# Altium schematic sheet Mux side B (5-8).SchDoc
size A0; SheetNumber: 3; SheetTotal: 5
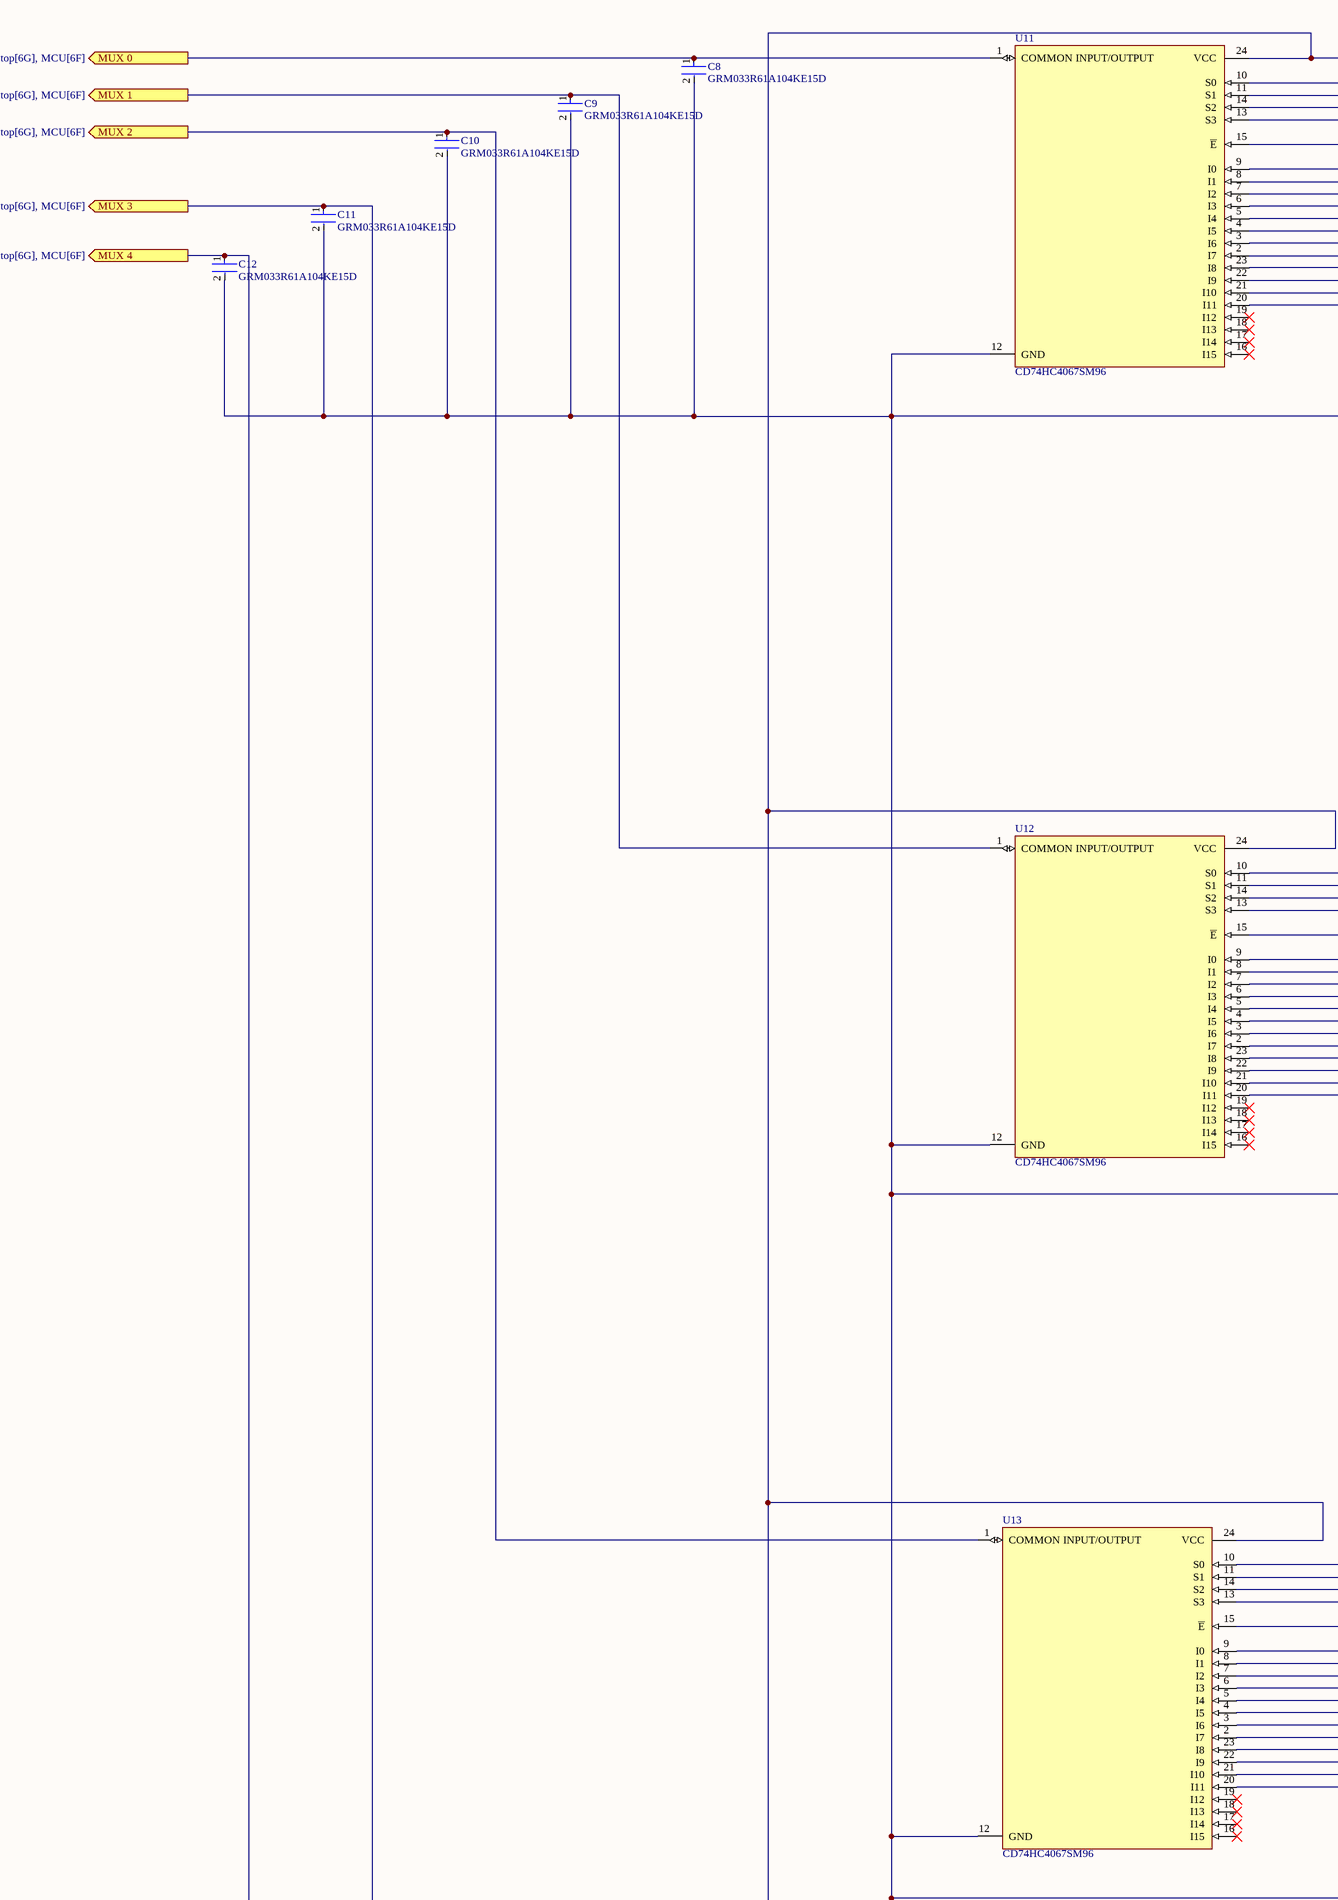
[diagram p0: Mux side B (5-8).SchDoc, top left]
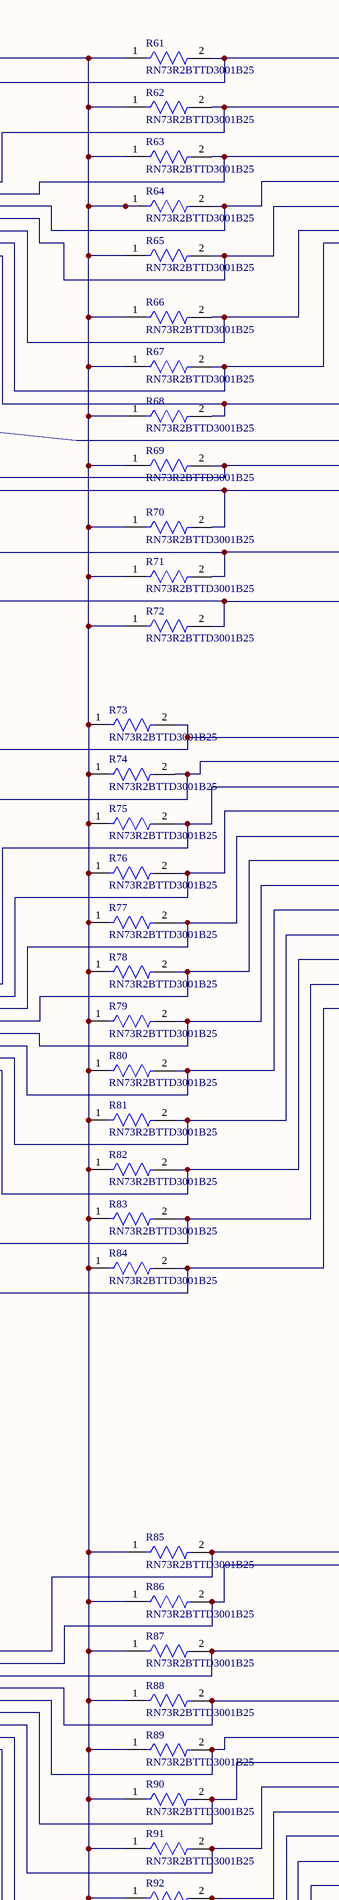
[diagram p1: Mux side B (5-8).SchDoc, top middle]
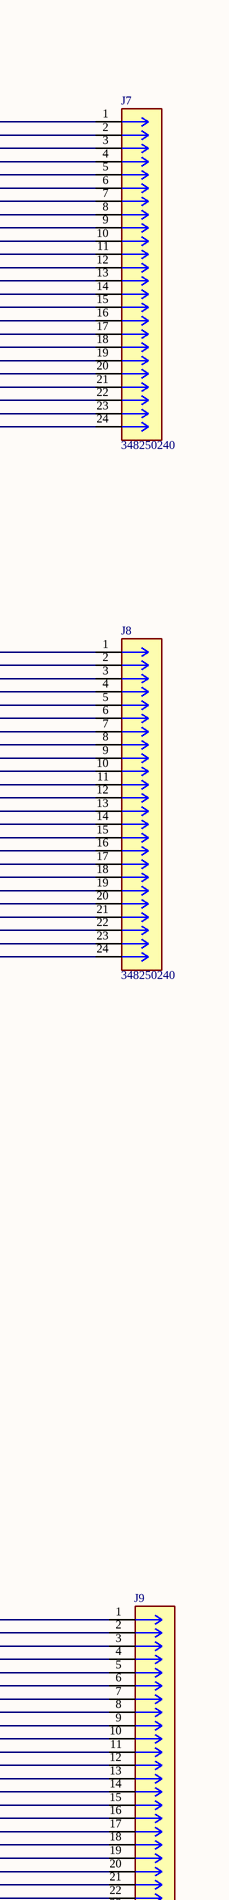
[diagram p2: Mux side B (5-8).SchDoc, top right]
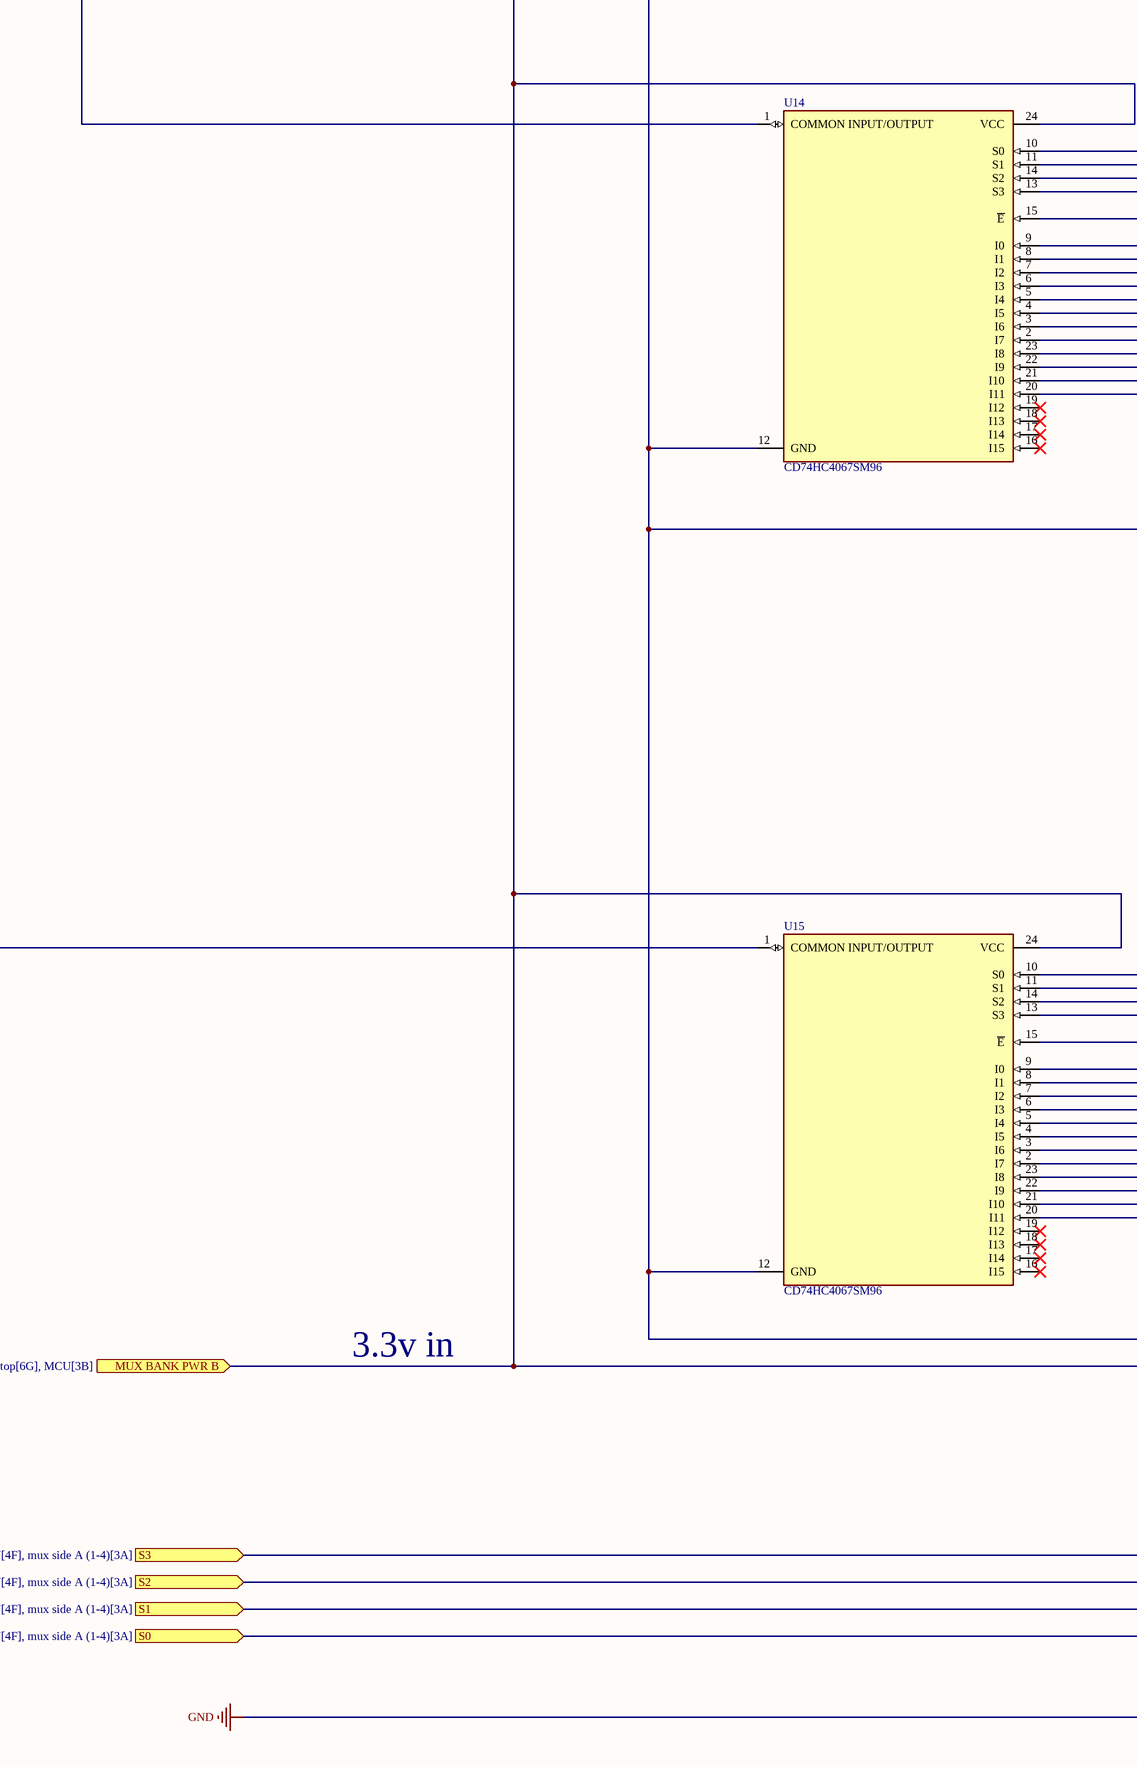
[diagram p3: Mux side B (5-8).SchDoc, bottom left]
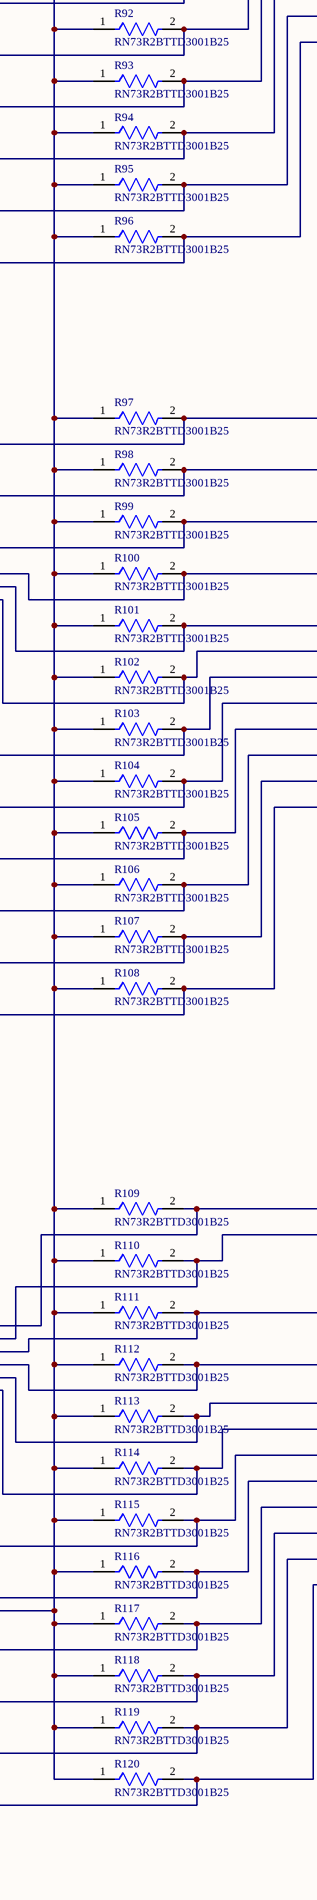
[diagram p4: Mux side B (5-8).SchDoc, bottom middle]
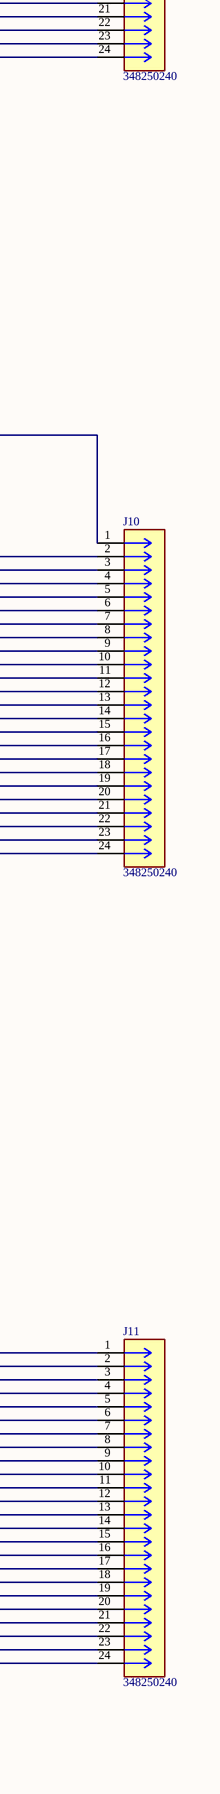
[diagram p5: Mux side B (5-8).SchDoc, bottom right]

## Parts
C8  GRM033R61A104KE15D  [FP-GRM033-0_03-IPC_C]
C9  GRM033R61A104KE15D  [FP-GRM033-0_03-IPC_C]
C10  GRM033R61A104KE15D  [FP-GRM033-0_03-IPC_C]
C11  GRM033R61A104KE15D  [FP-GRM033-0_03-IPC_C]
C12  GRM033R61A104KE15D  [FP-GRM033-0_03-IPC_C]
J7  348250240  [CONN_SD-34825-001_24_MOL]
J8  348250240  [CONN_SD-34825-001_24_MOL]
J9  348250240  [CONN_SD-34825-001_24_MOL]
J10  348250240  [CONN_SD-34825-001_24_MOL]
J11  348250240  [CONN_SD-34825-001_24_MOL]
R61  RN73R2BTTD3001B25  [FP-RN73R2B-IPC_A]
R62  RN73R2BTTD3001B25  [FP-RN73R2B-IPC_A]
R63  RN73R2BTTD3001B25  [FP-RN73R2B-IPC_A]
R64  RN73R2BTTD3001B25  [FP-RN73R2B-IPC_A]
R65  RN73R2BTTD3001B25  [FP-RN73R2B-IPC_A]
R66  RN73R2BTTD3001B25  [FP-RN73R2B-IPC_A]
R67  RN73R2BTTD3001B25  [FP-RN73R2B-IPC_A]
R68  RN73R2BTTD3001B25  [FP-RN73R2B-IPC_A]
R69  RN73R2BTTD3001B25  [FP-RN73R2B-IPC_A]
R70  RN73R2BTTD3001B25  [FP-RN73R2B-IPC_A]
R71  RN73R2BTTD3001B25  [FP-RN73R2B-IPC_A]
R72  RN73R2BTTD3001B25  [FP-RN73R2B-IPC_A]
R73  RN73R2BTTD3001B25  [FP-RN73R2B-IPC_A]
R74  RN73R2BTTD3001B25  [FP-RN73R2B-IPC_A]
R75  RN73R2BTTD3001B25  [FP-RN73R2B-IPC_A]
R76  RN73R2BTTD3001B25  [FP-RN73R2B-IPC_A]
R77  RN73R2BTTD3001B25  [FP-RN73R2B-IPC_A]
R78  RN73R2BTTD3001B25  [FP-RN73R2B-IPC_A]
R79  RN73R2BTTD3001B25  [FP-RN73R2B-IPC_A]
R80  RN73R2BTTD3001B25  [FP-RN73R2B-IPC_A]
R81  RN73R2BTTD3001B25  [FP-RN73R2B-IPC_A]
R82  RN73R2BTTD3001B25  [FP-RN73R2B-IPC_A]
R83  RN73R2BTTD3001B25  [FP-RN73R2B-IPC_A]
R84  RN73R2BTTD3001B25  [FP-RN73R2B-IPC_A]
R85  RN73R2BTTD3001B25  [FP-RN73R2B-IPC_A]
R86  RN73R2BTTD3001B25  [FP-RN73R2B-IPC_A]
R87  RN73R2BTTD3001B25  [FP-RN73R2B-IPC_A]
R88  RN73R2BTTD3001B25  [FP-RN73R2B-IPC_A]
R89  RN73R2BTTD3001B25  [FP-RN73R2B-IPC_A]
R90  RN73R2BTTD3001B25  [FP-RN73R2B-IPC_A]
R91  RN73R2BTTD3001B25  [FP-RN73R2B-IPC_A]
R92  RN73R2BTTD3001B25  [FP-RN73R2B-IPC_A]
R93  RN73R2BTTD3001B25  [FP-RN73R2B-IPC_A]
R94  RN73R2BTTD3001B25  [FP-RN73R2B-IPC_A]
R95  RN73R2BTTD3001B25  [FP-RN73R2B-IPC_A]
R96  RN73R2BTTD3001B25  [FP-RN73R2B-IPC_A]
R97  RN73R2BTTD3001B25  [FP-RN73R2B-IPC_A]
R98  RN73R2BTTD3001B25  [FP-RN73R2B-IPC_A]
R99  RN73R2BTTD3001B25  [FP-RN73R2B-IPC_A]
R100  RN73R2BTTD3001B25  [FP-RN73R2B-IPC_A]
R101  RN73R2BTTD3001B25  [FP-RN73R2B-IPC_A]
R102  RN73R2BTTD3001B25  [FP-RN73R2B-IPC_A]
R103  RN73R2BTTD3001B25  [FP-RN73R2B-IPC_A]
R104  RN73R2BTTD3001B25  [FP-RN73R2B-IPC_A]
R105  RN73R2BTTD3001B25  [FP-RN73R2B-IPC_A]
R106  RN73R2BTTD3001B25  [FP-RN73R2B-IPC_A]
R107  RN73R2BTTD3001B25  [FP-RN73R2B-IPC_A]
R108  RN73R2BTTD3001B25  [FP-RN73R2B-IPC_A]
R109  RN73R2BTTD3001B25  [FP-RN73R2B-IPC_A]
R110  RN73R2BTTD3001B25  [FP-RN73R2B-IPC_A]
R111  RN73R2BTTD3001B25  [FP-RN73R2B-IPC_A]
R112  RN73R2BTTD3001B25  [FP-RN73R2B-IPC_A]
R113  RN73R2BTTD3001B25  [FP-RN73R2B-IPC_A]
R114  RN73R2BTTD3001B25  [FP-RN73R2B-IPC_A]
R115  RN73R2BTTD3001B25  [FP-RN73R2B-IPC_A]
R116  RN73R2BTTD3001B25  [FP-RN73R2B-IPC_A]
R117  RN73R2BTTD3001B25  [FP-RN73R2B-IPC_A]
R118  RN73R2BTTD3001B25  [FP-RN73R2B-IPC_A]
R119  RN73R2BTTD3001B25  [FP-RN73R2B-IPC_A]
R120  RN73R2BTTD3001B25  [FP-RN73R2B-IPC_A]
U11  CD74HC4067SM96  [FP-DB0024A-IPC_C]
U12  CD74HC4067SM96  [FP-DB0024A-IPC_C]
U13  CD74HC4067SM96  [FP-DB0024A-IPC_C]
U14  CD74HC4067SM96  [FP-DB0024A-IPC_C]
U15  CD74HC4067SM96  [FP-DB0024A-IPC_C]

## Ports
MUX 0 (out, see temp sense 2.0 top[6G], MCU[6F]), MUX 1 (out, see temp sense 2.0 top[6G], MCU[6F]), MUX 2 (out, see temp sense 2.0 top[6G], MCU[6F]), MUX 3 (out, see temp sense 2.0 top[6G], MCU[6F]), MUX 4 (out, see temp sense 2.0 top[6G], MCU[6F]), MUX BANK PWR B (in, see temp sense 2.0 top[6G], MCU[3B]), S0 (in, see temp sense 2.0 top[6J], MCU[4F], mux side A (1-4)[3A]), S1 (in, see temp sense 2.0 top[6J], MCU[4F], mux side A (1-4)[3A]), S2 (in, see temp sense 2.0 top[6J], MCU[4F], mux side A (1-4)[3A]), S3 (in, see temp sense 2.0 top[6J], MCU[4F], mux side A (1-4)[3A])

## Nets
GND: C8.2 C9.2 C10.2 C11.2 C12.2 J7.2 J7.4 J7.6 J7.8 J7.10 J7.12 J7.14 J7.16 J7.18 J7.20 J7.22 J7.24 J8.2 J8.4 J8.6 J8.8 J8.10 J8.12 J8.14 J8.16 J8.18 J8.20 J8.22 J8.24 J9.2 J9.4 J9.6 J9.8 J9.10 J9.12 J9.14 J9.16 J9.18 J9.20 J9.22 J9.24 J10.2 J10.4 J10.6 J10.8 J10.10 J10.12 J10.14 J10.16 J10.18 J10.20 J10.22 J10.24 J11.2 J11.4 J11.6 J11.8 J11.10 J11.12 J11.14 J11.16 J11.18 J11.20 J11.22 J11.24 U11.12(GND) U11.15(~{E}) U12.12(GND) U12.15(~{E}) U13.12(GND) U13.15(~{E}) U14.12(GND) U14.15(~{E}) U15.12(GND) U15.15(~{E})
MUX 0: C8.1 U11.1(COMMON_INPUT/OUTPUT) ; port MUX 0
MUX 1: C9.1 U12.1(COMMON_INPUT/OUTPUT) ; port MUX 1
MUX 2: C10.1 U13.1(COMMON_INPUT/OUTPUT) ; port MUX 2
MUX 3: C11.1 U14.1(COMMON_INPUT/OUTPUT) ; port MUX 3
MUX 4: C12.1 U15.1(COMMON_INPUT/OUTPUT) ; port MUX 4
MUX BANK PWR B: R61.1 R62.1 R63.1 R64.1 R65.1 R66.1 R67.1 R68.1 R69.1 R70.1 R71.1 R72.1 R73.1 R74.1 R75.1 R76.1 R77.1 R78.1 R79.1 R80.1 R81.1 R82.1 R83.1 R84.1 R85.1 R86.1 R87.1 R88.1 R89.1 R90.1 R91.1 R92.1 R93.1 R94.1 R95.1 R96.1 R97.1 R98.1 R99.1 R100.1 R101.1 R102.1 R103.1 R104.1 R105.1 R106.1 R107.1 R108.1 R109.1 R110.1 R111.1 R112.1 R113.1 R114.1 R115.1 R116.1 R117.1 R118.1 R119.1 R120.1 U11.24(VCC) U12.24(VCC) U13.24(VCC) U14.24(VCC) U15.24(VCC) ; port MUX BANK PWR B
S0: U11.10(S0) U12.10(S0) U13.10(S0) U14.10(S0) U15.10(S0) ; port S0
S1: U11.11(S1) U12.11(S1) U13.11(S1) U14.11(S1) U15.11(S1) ; port S1
S2: U11.14(S2) U12.14(S2) U13.14(S2) U14.14(S2) U15.14(S2) ; port S2
S3: U11.13(S3) U12.13(S3) U13.13(S3) U14.13(S3) U15.13(S3) ; port S3
NetJ7_1: J7.1 R61.2 U11.9(I0)
NetJ7_3: J7.3 R62.2 U11.8(I1)
NetJ7_5: J7.5 R63.2 U11.7(I2)
NetJ7_7: J7.7 R64.2 U11.6(I3)
NetJ7_9: J7.9 R65.2 U11.5(I4)
NetJ7_11: J7.11 R66.2 U11.4(I5)
NetJ7_13: J7.13 R67.2 U11.3(I6)
NetJ7_15: J7.15 R68.2 U11.2(I7)
NetJ7_17: J7.17 R69.2 U11.23(I8)
NetJ7_19: J7.19 R70.2 U11.22(I9)
NetJ7_21: J7.21 R71.2 U11.21(I10)
NetJ7_23: J7.23 R72.2 U11.20(I11)
NetJ8_1: J8.1 R73.2 U12.9(I0)
NetJ8_3: J8.3 R74.2 U12.8(I1)
NetJ8_5: J8.5 R75.2 U12.7(I2)
NetJ8_7: J8.7 R76.2 U12.6(I3)
NetJ8_9: J8.9 R77.2 U12.5(I4)
NetJ8_11: J8.11 R78.2 U12.4(I5)
NetJ8_13: J8.13 R79.2 U12.3(I6)
NetJ8_15: J8.15 R80.2 U12.2(I7)
NetJ8_17: J8.17 R81.2 U12.23(I8)
NetJ8_19: J8.19 R82.2 U12.22(I9)
NetJ8_21: J8.21 R83.2 U12.21(I10)
NetJ8_23: J8.23 R84.2 U12.20(I11)
NetJ9_1: J9.1 R85.2 U13.9(I0)
NetJ9_3: J9.3 R86.2 U13.8(I1)
NetJ9_5: J9.5 R87.2 U13.7(I2)
NetJ9_7: J9.7 R88.2 U13.6(I3)
NetJ9_9: J9.9 R89.2 U13.5(I4)
NetJ9_11: J9.11 R90.2 U13.4(I5)
NetJ9_13: J9.13 R91.2 U13.3(I6)
NetJ9_15: J9.15 R92.2 U13.2(I7)
NetJ9_17: J9.17 R93.2 U13.23(I8)
NetJ9_19: J9.19 R94.2 U13.22(I9)
NetJ9_21: J9.21 R95.2 U13.21(I10)
NetJ9_23: J9.23 R96.2 U13.20(I11)
NetJ10_1: J10.1 R97.2 U14.9(I0)
NetJ10_3: J10.3 R98.2 U14.8(I1)
NetJ10_5: J10.5 R99.2 U14.7(I2)
NetJ10_7: J10.7 R100.2 U14.6(I3)
NetJ10_9: J10.9 R101.2 U14.5(I4)
NetJ10_11: J10.11 R102.2 U14.4(I5)
NetJ10_13: J10.13 R103.2 U14.3(I6)
NetJ10_15: J10.15 R104.2 U14.2(I7)
NetJ10_17: J10.17 R105.2 U14.23(I8)
NetJ10_19: J10.19 R106.2 U14.22(I9)
NetJ10_21: J10.21 R107.2 U14.21(I10)
NetJ10_23: J10.23 R108.2 U14.20(I11)
NetJ11_1: J11.1 R109.2 U15.9(I0)
NetJ11_3: J11.3 R110.2 U15.8(I1)
NetJ11_5: J11.5 R111.2 U15.7(I2)
NetJ11_7: J11.7 R112.2 U15.6(I3)
NetJ11_9: J11.9 R113.2 U15.5(I4)
NetJ11_11: J11.11 R114.2 U15.4(I5)
NetJ11_13: J11.13 R115.2 U15.3(I6)
NetJ11_15: J11.15 R116.2 U15.2(I7)
NetJ11_17: J11.17 R117.2 U15.23(I8)
NetJ11_19: J11.19 R118.2 U15.22(I9)
NetJ11_21: J11.21 R119.2 U15.21(I10)
NetJ11_23: J11.23 R120.2 U15.20(I11)

Not connected (* = marked no-connect by the designer): U11 16(I15)* 17(I14)* 18(I13)* 19(I12)*; U12 16(I15)* 17(I14)* 18(I13)* 19(I12)*; U13 16(I15)* 17(I14)* 18(I13)* 19(I12)*; U14 16(I15)* 17(I14)* 18(I13)* 19(I12)*; U15 16(I15)* 17(I14)* 18(I13)* 19(I12)*

## Notes on the sheet
- 3.3v in

## Library data of the parts
C8-C12 = CMP-2010-01264-2: Chip Multilayer Ceramic Capacitors for General Purpose, 0201, 0.10uF, X5R, 15%, 10%, 10V; Capacitance: 100nF; Mount: Surface Mount; Dielectric: X5R; Width: 0.012inch; Tolerance: 10%; Radiation Hardening: No; Voltage Rating: 10V; REACH SVHC: No SVHC; Height: 0.3mm; Max Operating Temperature: 85°C; Voltage Rating (DC): 10V; Thickness: 0.013inch; Termination: SMD/SMT; Lead Free: Lead Free; Package Quantity: 1; Case/Package: 0201; Min Operating Temperature: -55°C; Weight: 6E-06oz; Length: 0.6mm; Case Code (Imperial): 0201; Depth: 0.3mm; Voltage: 10V; Packaging: Tape and Reel; Case Code (Metric): 0603
R61-R120 = CMP-04015-056270-1: 3kΩ ±0.1% 0.25W, 1/4W Chip Resistor 1206 (3216 Metric) Moisture Resistant Thin Film
U11-U15 = CMP-04892-000038-1: IC MUX/DEMUX 1X16 24SSOP; Supply Type: Single; High Level Output Current: 25mA; Min Supply Voltage: 2V; Number of Circuits: 16; Max Supply Voltage: 6V; Number of Channels: 1; Turn-On Delay Time: 300ns; Max Supply Current: 8uA; Bandwidth: 89MHz; Turn-Off Delay Time: 290ns; Propagation Delay: 75ns; Logic Function: Multiplexer; On-State Resistance: 160R; Polarity: Non-Inverting; Width: 5.3mm; Case/Package: SSOP; Max Operating Temperature: 125°C; Mount: Surface Mount; Min Operating Temperature: -55°C; REACH SVHC: No SVHC; Contact Plating: Gold; Max Output Current: 25mA; Weight: 0.006081oz; Height: 1.95mm; Package Quantity: 2000; Length: 8.2mm; Lead Free: Lead Free; Operating Supply Current: 8uA; Packaging: Tape and Reel; Series: 74HC; Low Level Output Current: 25mA; Number of Outputs: 1; Termination: SMD/SMT; Number of Inputs: 16; Number of Bits: 16; Radiation Hardening: No; Number of Pins: 24
J7-J11 = 348250240: Package: None; Price: None; Value: *; MP: 348250240; Availability: Unavailable
  J9: ComponentLink1Description: New link; ComponentLink1URL: *; ComponentLink2Description: New link 1; ComponentLink2URL: *